# EAGLE design Adafruit MLX90393 QT (EAGLE 9.6.2)
COMPANY: ADAFRUIT INDUSTRIES; DRAWN: KTOWN; REV: C; YEAR: 2019
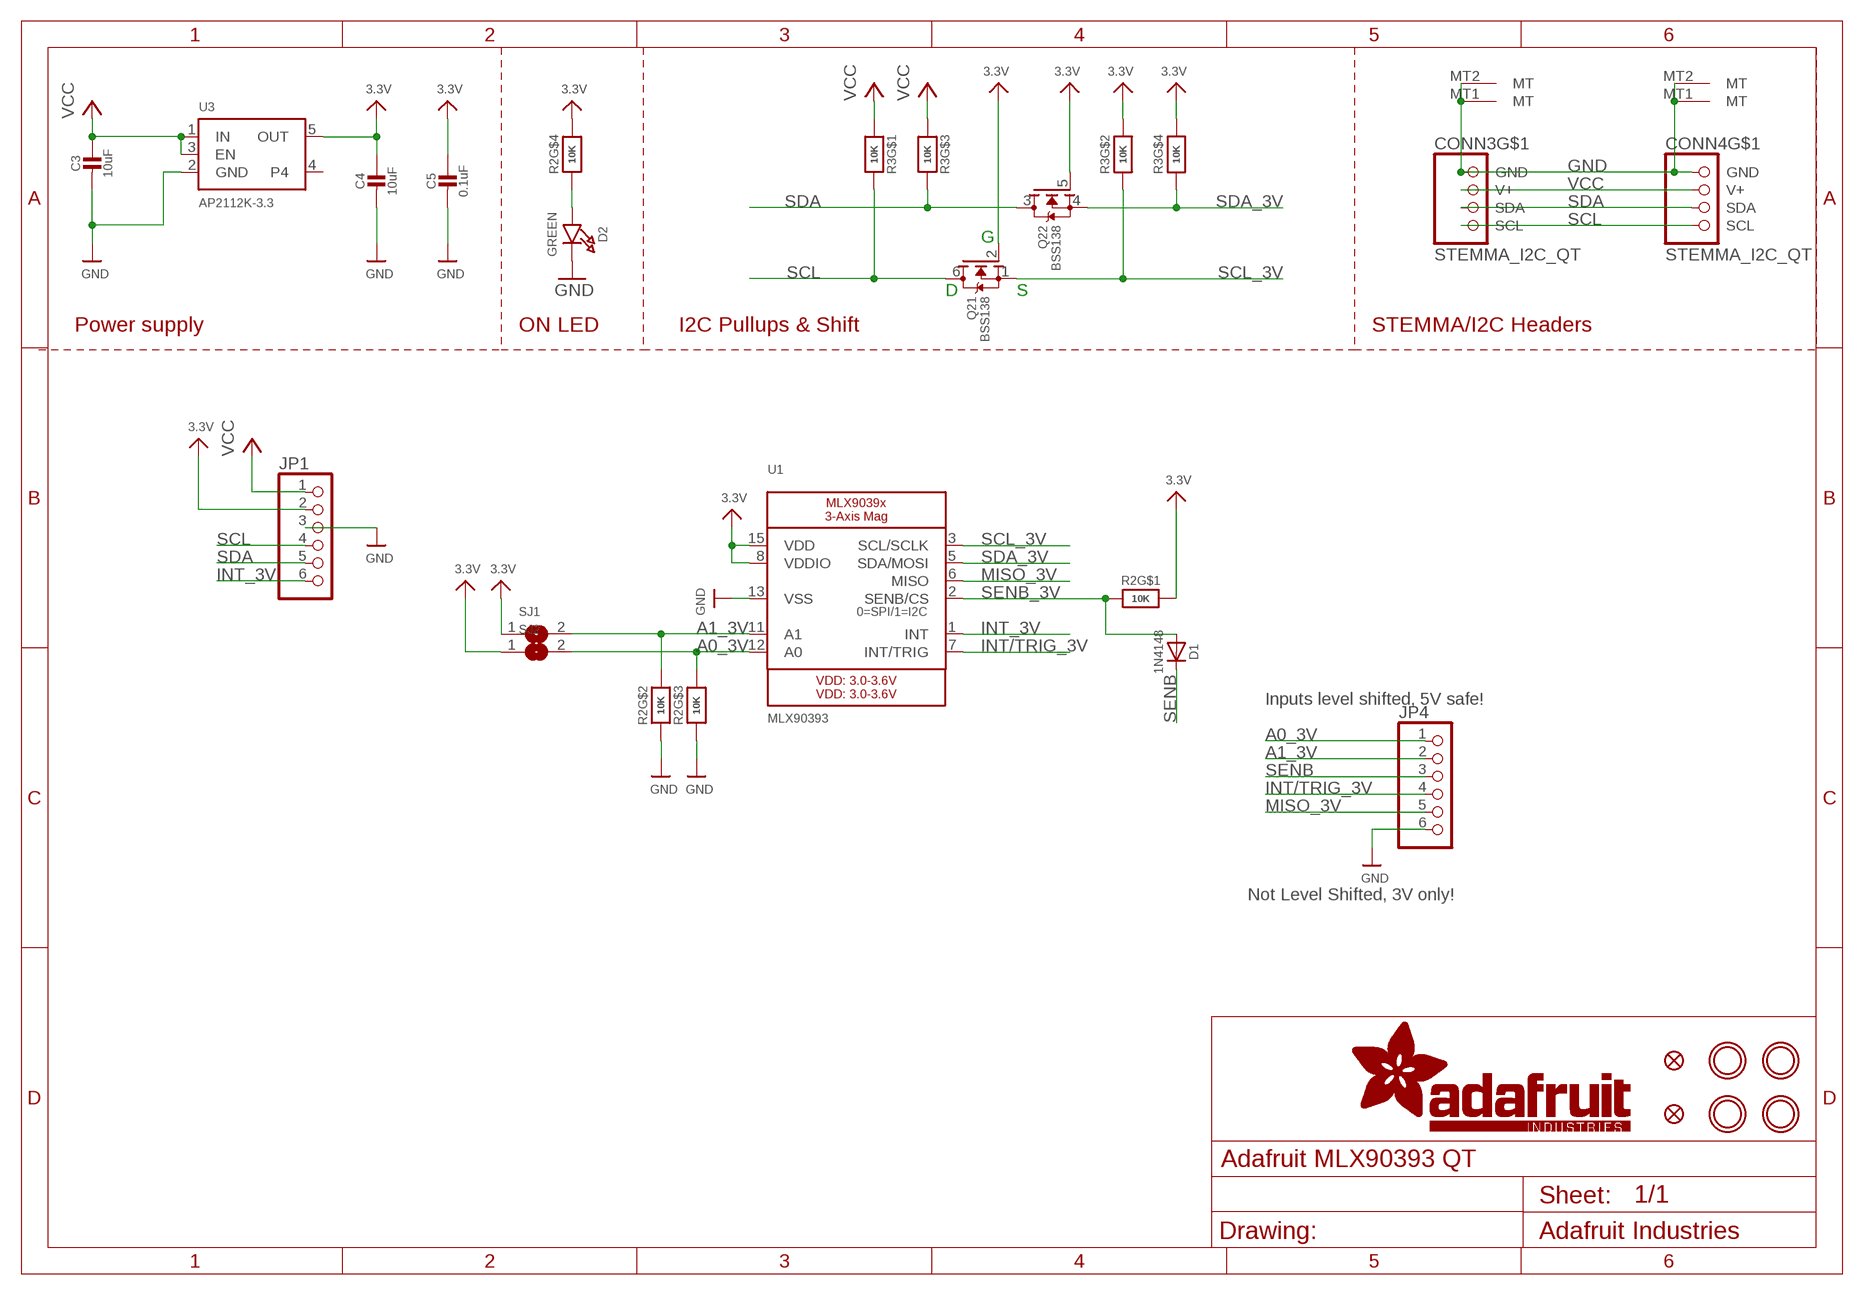
[diagram p0: schematic, sheet 1]

## Parts
C3  10uF  CAP_CERAMIC0805-NOOUTLINE  [0805-NO]
C4  10uF  CAP_CERAMIC0805-NOOUTLINE  [0805-NO]
C5  0.1uF  CAP_CERAMIC0603_NO  [0603-NO]
CONN3  STEMMA_I2C_QT  [JST_SH4]
CONN4  STEMMA_I2C_QT  [JST_SH4]
D1  1N4148  DIODE_SOD323MINI  [SOD-323_MINI]
D2  GREEN  LED0603_NOOUTLINE  [CHIPLED_0603_NOOUTLINE]
FID2  FIDUCIAL_1MM  [FIDUCIAL_1MM]
FID4  FIDUCIAL_1MM  [FIDUCIAL_1MM]
JP1  HEADER-1X670MIL  [1X06_ROUND_70]
JP4  HEADER-1X670MIL  [1X06_ROUND_70]
Q2  BSS138  MOSFET-N_DUAL  [SOT363]
R2  10K  RESISTOR_4PACK_NO  [RESPACK_4X0603_NO]
R3  10K  RESISTOR_4PACK  [RESPACK_4X0603]
SJ1  SOLDERJUMPER  [SOLDERJUMPER_ARROW_NOPASTE]
SJ2  SOLDERJUMPER  [SOLDERJUMPER_ARROW_NOPASTE]
U1  MLX90393  [QFN16_3MM]
U3  AP2112K-3.3  VREG_SOT23-5  [SOT23-5]
U$33  MOUNTINGHOLE2.5  [MOUNTINGHOLE_2.5_PLATED]
U$34  MOUNTINGHOLE2.5  [MOUNTINGHOLE_2.5_PLATED]
U$36  MOUNTINGHOLE2.5  [MOUNTINGHOLE_2.5_PLATED]
U$37  MOUNTINGHOLE2.5  [MOUNTINGHOLE_2.5_PLATED]

## Nets
3.3V: C4.1 C5.1 JP1.2 Q2.2(1:G) Q2.5(2:G) R2.5 R2.8 R3.2 R3.4 SJ1.1 SJ2.1 U1.8(VDDIO) U1.15(VDD) U3.5(OUT)
A0_3V: JP4.1 R2.6 SJ2.2 U1.12(A0)
A1_3V: JP4.2 R2.7 SJ1.2 U1.11(A1)
GND: C3.2 C4.2 C5.2 CONN3.1(GND) CONN3.MT1(MT) CONN3.MT2(MT) CONN4.1(GND) CONN4.MT1(MT) CONN4.MT2(MT) D2.C JP1.3 JP4.6 R2.2 R2.3 U1.13(VSS) U3.2(GND)
INT/TRIG_3V: JP4.4 U1.7(INT/TRIG)
INT_3V: JP1.6 U1.1(INT)
MISO_3V: JP4.5 U1.6(MISO)
N$1: D2.A R2.4
SCL: CONN3.4(SCL) CONN4.4(SCL) JP1.4 Q2.6(1:D) R3.8
SCL_3V: Q2.1(1:S) R3.7 U1.3(SCL/SCLK)
SDA: CONN3.3(SDA) CONN4.3(SDA) JP1.5 Q2.3(2:D) R3.6
SDA_3V: Q2.4(2:S) R3.5 U1.5(SDA/MOSI)
SENB: D1.C JP4.3
SENB_3V: D1.A R2.1 U1.2(SENB/CS)
VCC [highpower]: C3.1 CONN3.2(V+) CONN4.2(V+) JP1.1 R3.1 R3.3 U3.1(IN) U3.3(EN)
Unconnected: U3.4

## Notes on the sheet
- G
- D | S
- Power supply | ON LED | I2C Pullups & Shift | STEMMA/I2C Headers
- Inputs level shifted, 5V safe!
- Not Level Shifted, 3V only!

## Library data of the parts
C3-C5 = microbuilder:CAP_CERAMIC: Ceramic Capacitors For new designs, use the packages preceded by an '_' character since they are more reliable: The following footprints should be used on most boards: _0402 - Standard footprint for regular board layouts _0603 - Standard footprint for regular board layouts _0805 - Standard footprint for regular board layouts _1206 - Standard footprint for regular board layouts For extremely tight-pitch boards where space is at a premium, the following 'micro-pitch' footprints can be used (smaller pads, no silkscreen outline, etc.): _0402MP - Micro-pitch footprint for very dense/compact boards _0603MP - Micro-pitch footprint for very dense/compact boards _0805MP - Micro-pitch footprint for very dense/compact boards _1206MP - Micro-pitch footprint for very dense/compact boards
CONN3 CONN4 = microbuilder:STEMMA_I2C
D1 = microbuilder:DIODE: Diode SMA Model Volts Amps Type Vf Ir Digikey # Notes SSA34-E3 40V 3A Schottky 480mV @ 3A 200uA @ 40V SSA34-E3/61TGITR-ND CDBA120-G 20V 1A Schottky 500mV @ 1A 500uA @ 20V 641-1014-6-ND REEL MBRA210 10V 2A Schottky 350mV @ 2A 700uA @ 10V MBRA210LT3 SOD-123 Model Volts Amps Type Vf Ir Order # Notes BAT54T1G 30V 200mA Schottky 800mV @ 200mA 2uA @ 25V BAT54T1GOSTR-ND B0530W 30V 500mA Schottky 430mV @ 500mA 130uA @ 30V B0530W-FDICT-ND REEL MBR120 20V 1A Schottky 340mV @ 1A MBR120VLSFT1GOSCT-ND SOD-323 Model Volts Amps Type Vf Ir Order # Notes PMEG2005EJ 20V 500mA Schottky 355mV @ 500mA 568-4110-1-ND ZLLS410 10V 570mA Schottky 380mV @ 570mA ZLLS410CT-ND 1N4148WS 75V 150mA Silicon/Simple 1V 1N4148WSFSCT-ND REEL SOD-523 Model Volts Amps Type Vf Ir Order # Notes BAT54XV2 30V 200mA Schottky 0.8V @ 100mA BAT54XV2CT-ND TB751S 30V 30mA Schottky RB751S-40TE61CT-ND SOT23-R/W (R = Solder Paste/Reflow Ovens, W = Hand-Soldering) Model Volts Amps Type Vf Ir Order # Notes BAT54FILM 40V 300mA Schottky 497-7162-1-ND POWERDI-5 Model Volts Amps Type Vf Ir Order # Notes PDS560 60V 5A Schottky 670mV @ 5A 150uA @ 60V PDS560DICT-ND
D2 = microbuilder:LED: LED 0603 - 0603 Surface Mount Package 2mA: Green LED - Low Power (3.9mcd, 2ma, 1.7Vf) - Digikey: 475-2709-2-ND Orange LED - Low Power (9.8mcd, 2ma, 1.8Vf) - Digikey: 475-1194-2-ND Red LED - Low Power (5mcd, 2ma, 1.8Vf) - Digikey: 475-1195-2-ND Yellow LED - Low Power (7mcd, 2ma, 1.8Vf) - Digikey: 475-1196-2-ND 5mA: Blue LED - Low Power (17mcd, 5ma, 2.9Vf) - Digikey: LNJ937W8CRACT-ND 0805 - 0805 Surface Mount Package 2mA: Red LED (8.8mcd, 2mA, 1.8Vf, Clear) - Low Power [Digikey: 475-2510-1-ND] Green LED (5mcd, 2mA, 1.8Vf, Clear) - Low Power [Digikey: 475-2730-1-ND] Yellow LED (11.3mcd, 2mA, 1.8Vf, Clear) - Low Power [Digikey: 475-2555-1-ND] 20mA: Red LED (104mcd, 20mA, Diffused) - LS R976 [Digikey: 475-1278-6-ND] Red LED (12mcd, 20mA, 2.0Vf, Clear) - APT2012EC [Digikey: 754-1128-1-ND] Green LED (15mcd, 20mA, 2.2Vf, Clear) - APT2012GC [Digikey: 754-1131-1-ND] Orange LED (160mcd, 20mA, 2.1Vf, Clear) - APT2012SECK [Digikey: 754-1130-1-ND] 1206 - 1206 Surface Mount Package Green LED (26mcd, 20mA, Diffused) - LG N971 [Digikey: 475-1407-6-ND] Red LED (15mcd, 20mA, Diffused) - LH N974 [Digikey: 475-1416-6-ND] Cree - Cree High-Power Surface Mount LEDs XPEBWT-L1-0000-00D50 - White 111lm 350mA 2.9Vf 6200K 110° XTEAWT-00-0000-00000LEE3 - White 114lm 350mA 2.85Vf 5000K 115° Everlight - Everlight 45-21 Series Surface Mount LEDs 45-21/QK2C-B2832AC2CB2/2T - Warm White 2000mcd 20mA 3.25Vf 3050K 120° 45-21/LK2C-B38452C4CB2/2T - Nuetral White 2000mcd 20mA 3.25Vf 4150K 120° 45-21/LK2C-B50634C6CB2/2T - Cold White 2200mcd 20mA 3.25Vf 5650K 120° PLCC2 Reverse Mount LS T77K-J1L2-1-0-2-R18-Z - Red 11.25mcd 2mA 1.8Vf 630nm 120° LO T77K-L1M2-24-Z - Orange 19.6mcd 2mA 1.8Vf 606nm 120° LY T77K-K2M1-26-Z - Yellow 15.7mcd 2mA 1.8Vf 587nm 120°
FID2 FID4 = microbuilder:FIDUCIAL: Fiducial Alignment Points Various fiducial points for machine vision alignment.; BOM: EXCLUDE
JP1 JP4 = microbuilder:HEADER-1X6: PIN HEADER
Q2 = microbuilder:MOSFET-N_DUAL: Dual N-Channel MOSFET SOT363 (2.0x1.25mm) 2N7002PS - 60V, 320mA [Digikey: 568-5984-1-ND]
R2 R3 = microbuilder:RESISTOR_4PACK: Resistor Packs (4 resistors) 4 x 0603 10K 1/16W - Digikey: YC164J-10KCT-ND
SJ1 SJ2 = microbuilder:SOLDERJUMPER: SMD Solder JUMPER Solder the two pads together to create a connection, or remove the solder to break it. REFLOW - Use this footprint for solder paste and reflow ovens. WAVE - Use this footprint for hand-soldering (larger pads). CLOSED - Has a trace between the two pads to ensure it is closed by default. The trace needs to be cut to disable the jumper, and can be closed again by creating a solder bridge between the two pads.; BOM: EXCLUDE
U1 = adafruit_sensor:MLX90393: MLX90393 - Wide Range 3 Axis Magnetometer
U3 = microbuilder:VREG_SOT23-5: SOT23-5 Fixed Voltage Regulators Part Current Out V Out V In V Dropout θJA (°C/W) TJ (°C) Digikey Part No. ADP121 150mA 3.3V 3.4-5.5V 0.09V @ 150mA -- -- ADP121-AUJZ33R7CT-ND ADP121 150mA 3.0V 3.1-5.5V 0.09V @ 150mA -- -- ADP121-AUJZ30R7CT-ND ADP122 300mA 3.3V 3.4-5.5V 0.085V @ 300mA -- -- ADP122AUJZ-3.3-R7CT-ND ADP1712 300mA 3.3V 3.5-5.5V 0.17V @ 300mA -- -- ADP1712AUJZ-3.3-R7TR-ND AP7311 (Low Cost) 150mA 3.3V 3.5-6V 0.15V @ 150mA -- -- AP7311-33WG-7DICT-ND LD39015M18R 150mA 1.8V 1.9V-5.5V 0.08V @ 100mA -- -- 497-6977-1-ND LP2985A-33DBVR 150mA 3.3V 3.3-16V 0.28V @ 150mA 206 150 296-18479-1-ND MCP1824T-3302E/OT 300mA 3.3V 3.5V-6V 0.2V @ 300mA -- -- MCP1824T-3302E/OTCT-ND MIC5205-2.5YM5 TR 150mA 2.5V 2.7-16V 0.165V @ 150mA -- -- 576-1257-2-ND MIC5205-3.0YM5 TR 150mA 3.0V 3.2V-16V 0.165V @ 150mA -- -- 576-1258-2-ND MIC5205-3.3YM5 TR 150mA 3.3V 3.5V-16V 0.165V @ 150mA -- -- 576-1259-2-ND TPS780330220 150mA 3.3V+2.2V 3.6-5.5V 250mV Max -- -- 296-23332-1-ND TDA3663/N1,135 100mA 3.3V 3.5-45V 0.18V @ 50mA -- -- 568-5343-1-ND Max operating temp can be calculated using θJA, TJ (max junction temperature), and power in watts. Set the "Maximum Ambient Temperature" until it reaches TJ ("Max Junction Temperature"), which is the absolute limit for safe use of the regulator: Heat Sink Temperature Calculator <http://www.daycounter.com/Calculators/Heat-Sink-Temperature-Calculator.phtml> For example, With 12V source into a 3.3V LP2985 and a 30mA load, we are dissipating (12V-3.3V) * 0.03A = 0.261W. With a θJA of 206 °C/W, a TJ of 150°C, and 261mW we can safely use the chip without a heat sink up to 75°C (=147.1°C Junction Temperature).
U$33 U$34 U$36 U$37 = microbuilder:MOUNTINGHOLE: Mounting Hole For #2 screws (0.086"/2.18mm width, 0.094"/2.4mm hole) use 2.5mm; BOM: EXCLUDE

## Net classes
1 highpower: width 0.305 mm, drill 0.483 mm
2 lowpower: width 0.254 mm, drill 0.483 mm

## Board
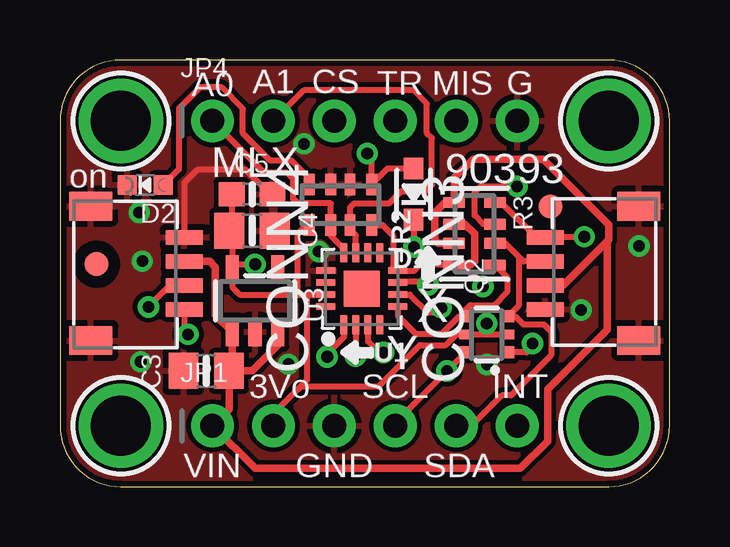
[diagram p1: board, top side]
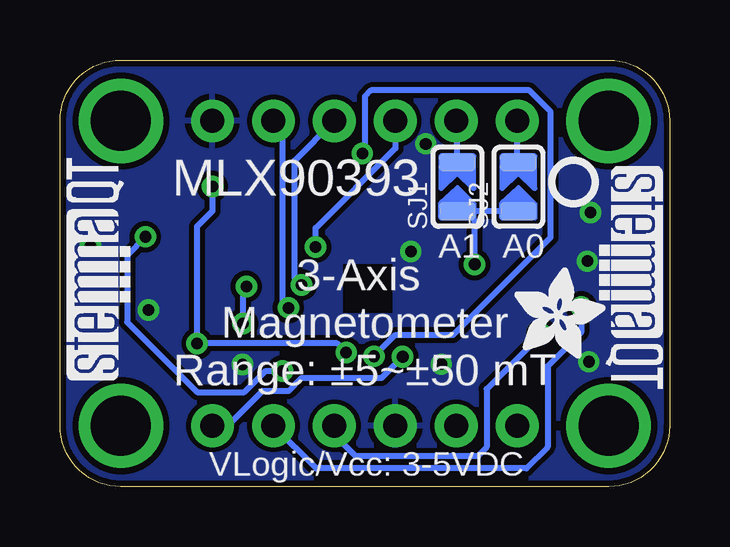
[diagram p2: board, bottom side, seen from below]

Size 25.4 x 17.78 mm. Coordinates in mm from the lower left corner, seen from the top.
Outline: 0,15.24 0,2.54 arc90 2.54,0 22.86,0 arc90 25.4,2.54 25.4,15.24 arc90 22.86,17.78 2.54,17.78 arc90 0,15.24
Copper layers (1*16): Top 0.035mm / dielectric 1.5mm / Bottom 0.035mm
Design rules "adafruit": minimum track width 8mil, minimum drill 15.5mil, track to track 8mil, track to pad 8mil, pad to pad 8mil, via to via 8mil, smd to smd 8mil, copper to edge 10mil, drill to drill 8mil, minimum pad ring 10mil, minimum via ring 8mil, stop-mask expansion 2mil, vias tented up to drill 20mil, thermal gap 10mil
tRestrict: area 11.6,7.2 to 13.6,9.3
bRestrict: area 11.6,7.2 to 13.6,9.3

### Footprints (pad centres in the part's own frame; a part is rotated, then mirrored left to right if it is on the bottom)
0805-NO = smd 1.24 x 1.5: 1 -0.95,0; 2 0.95,0
0603-NO = smd 1.075 x 1: 1 -0.85,0; 2 0.85,0
JST_SH4 = smd 0.6 x 1.55: 1 -1.5,2.514; 2 -0.5,2.514; 3 0.5,2.514; 4 1.5,2.514 | smd 1.2 x 1.8: MT1 -2.8,-1.386; MT2 2.8,-1.386
SOD-323_MINI = smd 0.9 x 0.8: A 1.07,0; C -1.07,0
CHIPLED_0603_NOOUTLINE = smd 0.8 x 0.8: A 0,-0.75; C 0,0.75
FIDUCIAL_1MM = smd 1 x 1: 1 0,0
1X06_ROUND_70 = drill 1 pad 1.778: 1 -6.35,0; 2 -3.81,0; 3 -1.27,0; 4 1.27,0; 5 3.81,0; 6 6.35,0
SOT363 = smd 0.5 x 0.5: 1 -0.75,-0.9; 3 0.75,-0.9; 4 0.75,0.9; 6 -0.75,0.9 | smd 0.4 x 0.5: 2 0,-0.9; 5 0,0.9
RESPACK_4X0603_NO = smd 0.45 x 0.9: 1 -1.3,-0.85; 2 -0.4,-0.85; 3 0.4,-0.85; 4 1.3,-0.85; 5 1.3,0.85; 6 0.4,0.85; 7 -0.4,0.85; 8 -1.3,0.85
RESPACK_4X0603 = smd 0.45 x 0.9: 1 -1.3,-0.85; 2 -0.4,-0.85; 3 0.4,-0.85; 4 1.3,-0.85; 5 1.3,0.85; 6 0.4,0.85; 7 -0.4,0.85; 8 -1.3,0.85
SOLDERJUMPER_ARROW_NOPASTE = smd 0.762 x 1.524: 1 -1.016,0; 2 1.016,0
QFN16_3MM = smd 0.8 x 0.28: 1 -1.5,0.75; 2 -1.5,0.25; 3 -1.5,-0.25; 4 -1.5,-0.75; 9 1.5,-0.75; 10 1.5,-0.25; 11 1.5,0.25; 12 1.5,0.75 | smd 0.28 x 0.8: 5 -0.75,-1.5; 6 -0.25,-1.5; 7 0.25,-1.5; 8 0.75,-1.5; 13 0.75,1.5; 14 0.25,1.5; 15 -0.25,1.5; 16 -0.75,1.5 | smd 1.5 x 1.5: THERMAL 0,0
SOT23-5 = smd 0.55 x 1.2: 1 -0.95,-1.3; 2 0,-1.3; 3 0.95,-1.3; 4 0.95,1.3; 5 -0.95,1.3
MOUNTINGHOLE_2.5_PLATED = drill 2.5 pad 3.2: P$1 0,0

### Placement (x,y rotation side)
C3  6.1,4.83 180 top
C4  8,10.67 0 top
C5  8,12.19 0 top
CONN3  22.73,8.89 90 top
CONN4  2.67,8.89 270 top
D1  14.73,12.19 90 top
D2  3.56,12.57 90 top
FID2  1.52,9.27 0 top
FID4  20.45,11.68 0 top
JP1  12.7,2.54 0 top
JP4  12.7,15.24 0 top
Q2  17.78,6.35 90 top
R2  11.68,11.75 180 top
R3  17.27,10.54 270 top
SJ1  8.84,12.5 90 bottom
SJ2  6.3,12.5 90 bottom
U1  12.57,8.26 90 top
U3  8.13,7.75 0 top
U$18  [PCBFEAT-REV-040]  4,12.7 0 bottom
U$33  2.54,15.24 0 top
U$34  22.86,15.24 0 top
U$36  2.54,2.54 0 top
U$37  22.86,2.54 0 top
U$39  [ADAFRUIT_3.5MM]  6.48,5.33 0 bottom
U$41  [STEMMAQT]  22.48,4.45 90 bottom
U$42  [STEMMAQT]  2.92,13.34 270 bottom

### Tracks (layer width: path | path; a pad name or v marks a point on that pad's centre or on a via)
3.3V  (via drill 0.48, 0.5)
  Top 0.254: U3.5 7.18,10.54 C4.1 7.15,10.77 C5.1 | U3.5 7.18,8.32 7.49,8.01 9.91,8.01 | 9.91,8.01 10.29,8.01 | 10.29,8.01 U1.15 | 17.91,6.35 Q2.5 16.52,6.35 16.08,5.91 15,5.91 13.27,4.18 10.08,4.18 10.08,4.22 9.91,4.04 9.91,4.06 | 17.91,6.35 Q2.2 | R2.5 10.26,10.9 9.9,10.54 9.9,8.01 9.91,8.01 | 10.29,8.01 10.29,4.45 9.91,4.06 | 9.91,4.06 8.89,3.05 JP1.2 | R2.8 13.44,10.9 13.88,10.46 13.88,9.2 U1.8 14.77,9.01 15.01,9.24 R3.4 16.73,9.24 v17.63,8.34 | 17.91,6.35 17.78,6.48 v17.78,6.79 | U3.5 7.39,9.26 v8.13,9.26
  Top 0.305: R3.2 16.87,10.94 17.27,10.54 17.27,9.4 17.11,9.24 R3.4
  Bottom 0.254: v17.63,8.34 17.78,8.2 v17.78,6.79 | SJ2.1 8.51,11.48 | 8.51,11.48 SJ1.1 | v8.13,9.26 8.13,11.1 8.51,11.48
A0_3V
  Top 0.254: U1.12 11.82,9.91 11.28,10.45 R2.6 11.28,11.81 9.91,11.81 9.72,12 9.72,12.83 9.47,13.08 8.51,13.08 JP4.1
  Bottom 0.254: SJ2.2 6.35,13.56 JP4.1
A1_3V
  Top 0.254: U1.11 12.32,10.47 12.08,10.71 R2.7 12.08,11.64 12.26,11.81 13.72,11.81 14.22,12.32 15.24,12.32 15.49,12.57 15.49,14.53 15.29,14.73 15.29,15.95 14.73,16.51 10.16,16.51 JP4.2
  Bottom 0.254: SJ1.2 8.84,15.19 JP4.2
GND  (via drill 0.48)
  Top 0.254: C5.2 8.75,12.19 7.74,13.2 5.71,13.2 5.18,12.67 CONN4.1
  other vias: 10.78,9.8 10.16,14.29 3.43,9.4 3.3,11.43 24.13,10.03 21.72,7.37 3.37,5.21 17.79,5.09 9.51,5.11
  pour Top: 0,17.78 25.4,17.78 25.4,0 0,0
  pour Bottom: 0,17.78 25.4,17.78 25.4,0 0,0
INT/TRIG_3V  (via drill 0.48)
  Top 0.254: U1.7 14.1,8.54 15.21,8.54 v15.33,8.41
  Bottom 0.254: v15.33,8.41 15.62,8.7 15.62,13.59 JP4.4
INT_3V  (via drill 0.5)
  Top 0.254: U1.1 11.82,6.24 11.12,5.54 v11.12,5.41
  Bottom 0.254: v11.12,5.41 12.01,4.52 15.34,4.52 15.87,3.99 16.97,3.99 18.41,2.54 JP1.6
MISO_3V  (via drill 0.48)
  Top 0.254: U1.6 14.58,8.01 15.34,7.24 15.82,7.24 15.82,7.39 v15.88,7.45
  Bottom 0.254: v15.88,7.45 15.95,7.52 16.13,7.52 16.13,14.86 JP4.5
N$1
  Top 0.254: D2.A 4.95,13.22 4.95,15.75 5.84,16.64 6.73,16.64 7.62,15.75 7.62,14.73 8.76,13.59 9.65,13.59 10.38,12.85 R2.4
SCL  (via drill 0.48)
  Top 0.254: R3.8 18.39,11.84 19.84,10.39 CONN3.4 21.82,10.39 v21.84,10.41 | Q2.6 16.88,5.58 v16.13,4.83 13.97,2.67 JP1.4 | CONN4.4 5.18,6.5 v5.33,6.35
  Bottom 0.254: v21.84,10.41 22.61,9.65 22.61,6.86 19.68,3.94 17.71,3.94 16.83,4.83 v16.13,4.83 | v5.33,6.35 7.62,4.06 7.62,1.65 8,1.27 13.08,1.27 13.97,2.16 JP1.4
SCL_3V  (via drill 0.48)
  Top 0.254: R3.7 17.63,10.94 17.27,11.3 17.27,12.26 17.53,12.51 v19.05,12.51 | v19.68,5.97 19.75,5.91 19.44,5.6 Q2.1 | v13.47,5.59 13.29,5.59 12.82,6.05 U1.3
  Bottom 0.254: v19.05,12.51 19.05,11.48 19.68,10.85 v19.68,5.97 13.86,5.97 v13.47,5.59
SDA  (via drill 0.48)
  Top 0.254: CONN3.3 19.31,9.39 19.11,9.59 | R3.6 18.56,10.14 19.11,9.59 | 19.11,9.59 19.11,7.53 Q2.3 18.97,7.1 19.31,6.76 20.16,6.76 20.46,6.46 20.46,5.47 18.8,3.81 18.41,3.81 17.14,2.54 JP1.5 | CONN4.3 4.58,8.39 v3.68,7.49
  Bottom 0.254: v3.68,7.49 3.68,6.43 5.08,5.03 5.08,1.65 5.97,0.76 14.73,0.76 JP1.5
SDA_3V
  Top 0.254: U1.5 14.07,7.12 14.84,6.36 15.89,6.36 16.63,7.1 Q2.4 16.88,7.35 17.09,7.57 18.09,7.57 18.63,8.11 18.63,8.73 R3.5
SENB  (via drill 0.48)
  Top 0.254: D1.C 14.73,10 v14.75,9.98
  Bottom 0.254: v14.75,9.98 14.75,10.77 11.43,14.1 JP4.3
SENB_3V  (via drill 0.48)
  Top 0.254: D1.A 13.65,13.26 R2.1 12.98,13.79 12.89,13.88 v12.8,13.88 | U1.2 v12.32,5.44
  Bottom 0.254: v12.32,5.44 11.43,6.33 9.02,6.33 4.95,10.39 4.95,15.62 5.84,16.51 12.45,16.51 12.7,16.26 12.7,13.99 v12.8,13.88
VCC
  Top 0.305: C3.1 7.18,4.96 U3.1 6.48,7.15 6.48,9.14 6.23,9.39 CONN4.2 | C3.1 8,4.83 9.08,5.9 U3.3 | CONN3.2 20.96,8.39 22.8,10.22 | 22.8,10.22 22.86,10.29 22.86,10.92 20.13,13.65 17.21,13.65 16.42,12.87 R3.1 16.03,11.84 15.62,11.43 15.62,10.29 15.77,10.14 R3.3 | C3.1 7.05,3.24 JP1.1 8.13,0.76 19.18,0.76 20.32,1.91 20.32,4.06 22.8,6.54 22.8,10.22

### Text on the board
tPlace: A0 | A1 | CS | TR | MIS | G | MLX | 90393 | on | X | Y | 3Vo | SCL | INT | VIN | GND | SDA
bPlace: MLX90393 | A0 | A1 | 3-Axis / Magnetometer / Range: ±5~±50 mT | VLogic/Vcc: 3-5VDC